# EAGLE schematic rpipowerhat (EAGLE 9.6.2)
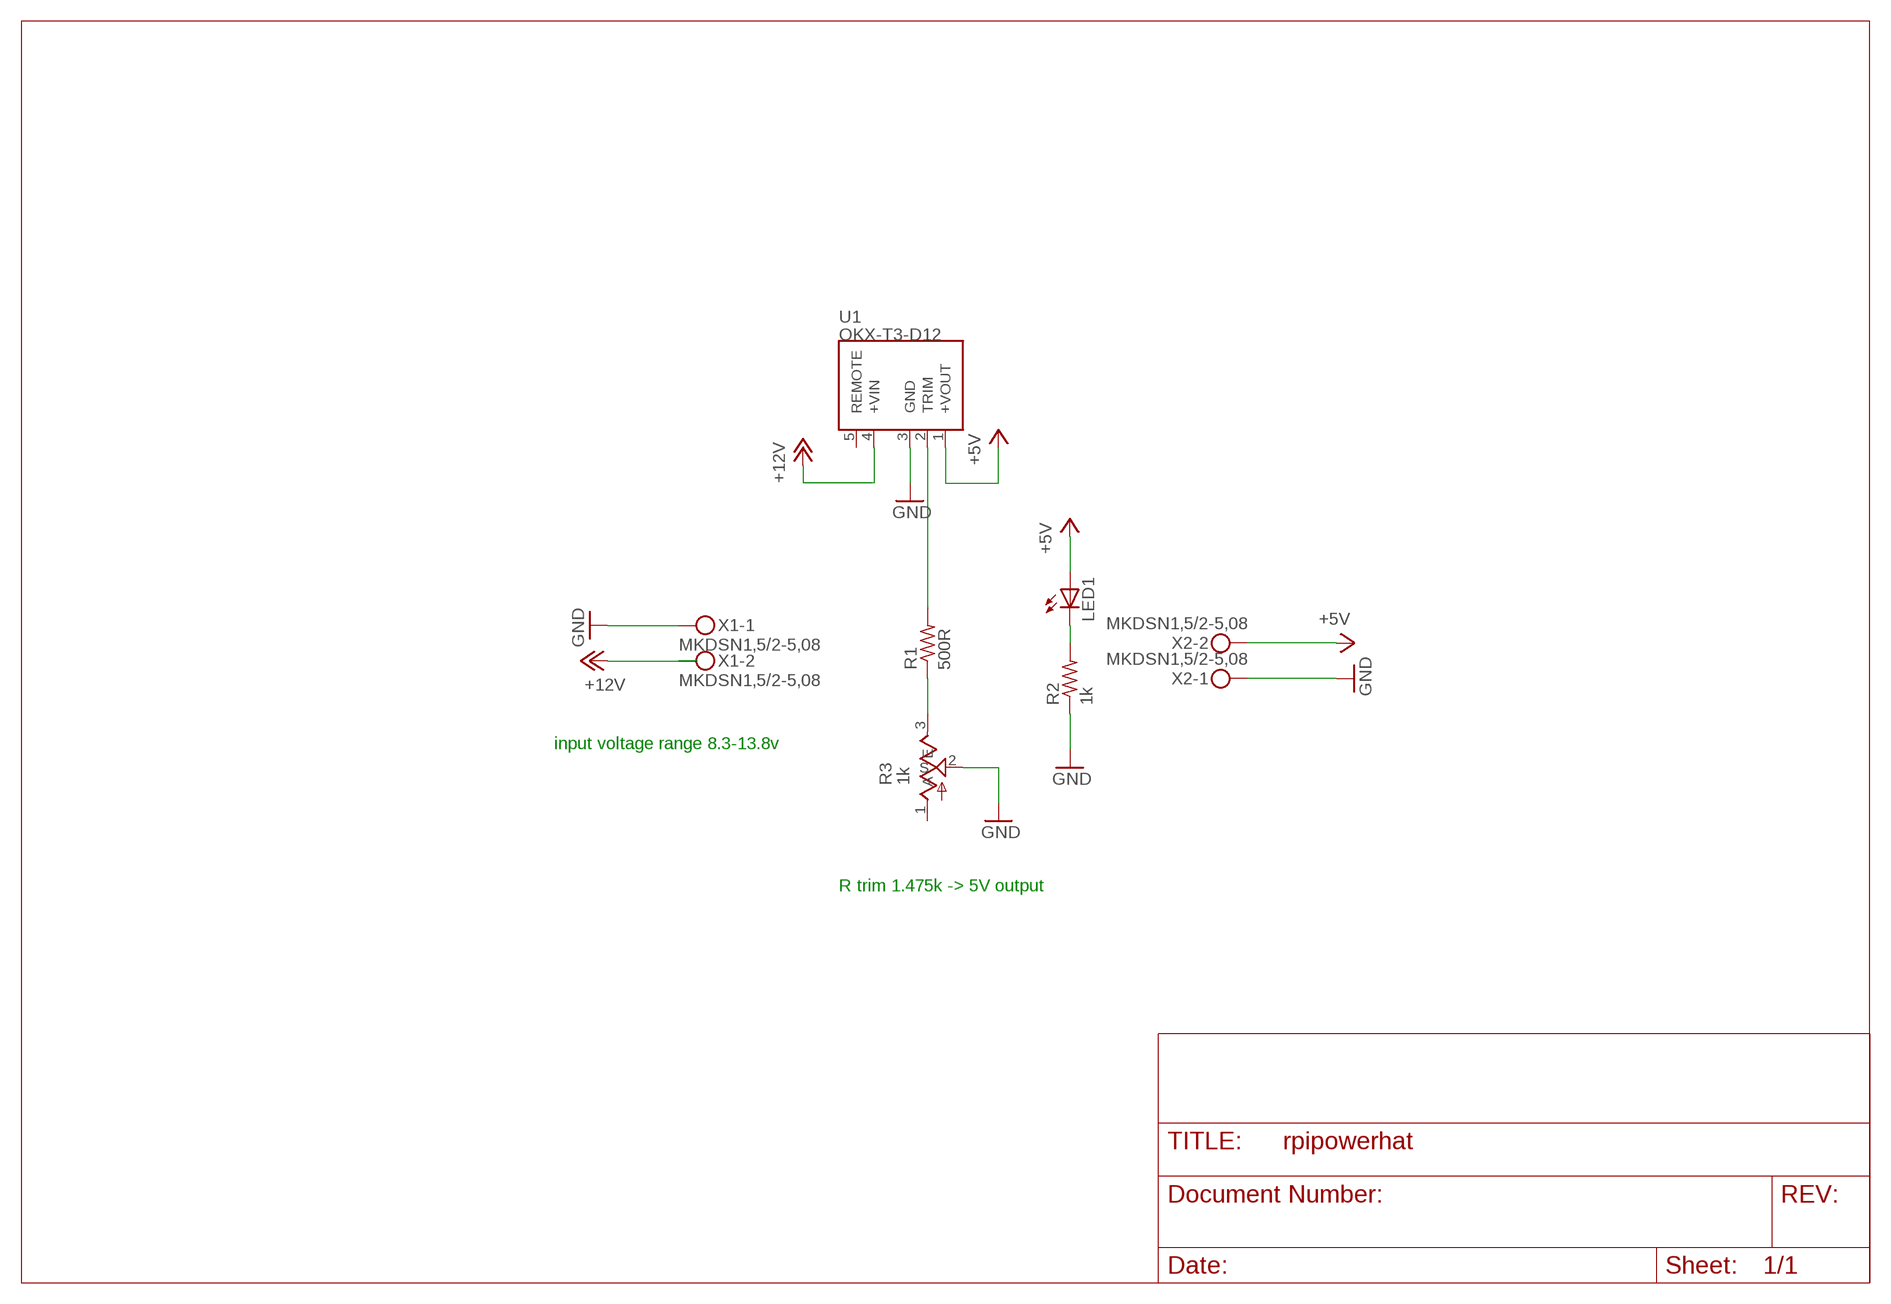
[diagram p0: schematic, sheet 1]

## Parts
LED1  LEDCHIPLED_0603  [CHIPLED_0603]
R1  500R  R-US_R0603  [R0603]
R2  1k  R-US_R0603  [R0603]
R3  1k  POT-3296  [RTRIM3296W]
U1  OKX-T3-D12  [OKX-T3-D12]
X1  MKDSN1,5/2-5,08  [MKDSN1,5/2-5,08]
X2  MKDSN1,5/2-5,08  [MKDSN1,5/2-5,08]

## Nets
+5V: LED1.A U1.1(+VOUT) X2.2
+12V: U1.4(+VIN) X1.2
GND: R2.1 R3.2(S) U1.3(GND) X1.1 X2.1
N$1: R1.1 R3.3(E)
N$2: R1.2 U1.2(TRIM)
N$3: LED1.C R2.2
Unconnected: R3.1(A) U1.5(REMOTE)

## Notes on the sheet
- input voltage range 8.3-13.8v
- R trim 1.475k -> 5V output

## Library data of the parts
LED1 = adafruit:LED: LED OSRAM: - CHIPLED LG R971, LG N971, LY N971, LG Q971, LY Q971, LO R971, LY R971 LH N974, LH R974 LS Q976, LO Q976, LY Q976 LO Q996 - Hyper CHIPLED LW Q18S LB Q993, LB Q99A, LB R99A - SideLED LS A670, LO A670, LY A670, LG A670, LP A670 LB A673, LV A673, LT A673, LW A673 LH A674 LY A675 LS A676, LA A676, LO A676, LY A676, LW A676 LS A679, LY A679, LG A679 - Hyper Micro SIDELED® LS Y876, LA Y876, LO Y876, LY Y876 LT Y87S - SmartLED LW L88C, LW L88S LB L89C, LB L89S, LG L890 LS L89K, LO L89K, LY L89K LS L896, LA L896, LO L896, LY L896 - TOPLED LS T670, LO T670, LY T670, LG T670, LP T670 LSG T670, LSP T670, LSY T670, LOP T670, LYG T670 LG T671, LOG T671, LSG T671 LB T673, LV T673, LT T673, LW T673 LH T674 LS T676, LA T676, LO T676, LY T676, LB T676, LH T676, LSB T676, LW T676 LB T67C, LV T67C, LT T67C, LS T67K, LO T67K, LY T67K, LW E67C LS E67B, LA E67B, LO E67B, LY E67B, LB E67C, LV E67C, LT E67C LW T67C LS T679, LY T679, LG T679 LS T770, LO T770, LY T770, LG T770, LP T770 LB T773, LV T773, LT T773, LW T773 LH T774 LS E675, LA E675, LY E675, LS T675 LS T776, LA T776, LO T776, LY T776, LB T776 LHGB T686 LT T68C, LB T68C - Hyper Mini TOPLED® LB M676 - Mini TOPLED Santana® LG M470 LS M47K, LO M47K, LY M47K Source: http://www.osram.convergy.de/
R1 R2 = rcl:R-US_: RESISTOR, American symbol; SPICEPREFIX: R
R3 = suhyouri:POT-
U1 = suhyouri:OKX-T3-D12: Murata OKX-T/3-D12N-C Adjustable 3-Amp SIP Non-Isolated DC/DC Converters https://www.digikey.kr/product-detail/ko/murata-power-solutions-inc/OKX-T-3-D12N-C/811-2623-ND/3314278
X1 X2 = con-phoenix-508:MKDSN1,5/2-5,08: MKDSN 1,5/ 2-5,08 Printklemme Nennstrom: 13,5 A Nennspannung: 250 V Rastermaß: 5,08 mm Polzahl: 2 Anschlussart: Schraubanschluss Montage: Löten Anschlussrichtung Leiter/Platine: 0 ° Artikelnummer: 1729128 Source: http://eshop.phoenixcontact.com .. 1729128.pdf